# EAGLE design MakeSpaceBadge-1 (EAGLE 7.4.0)
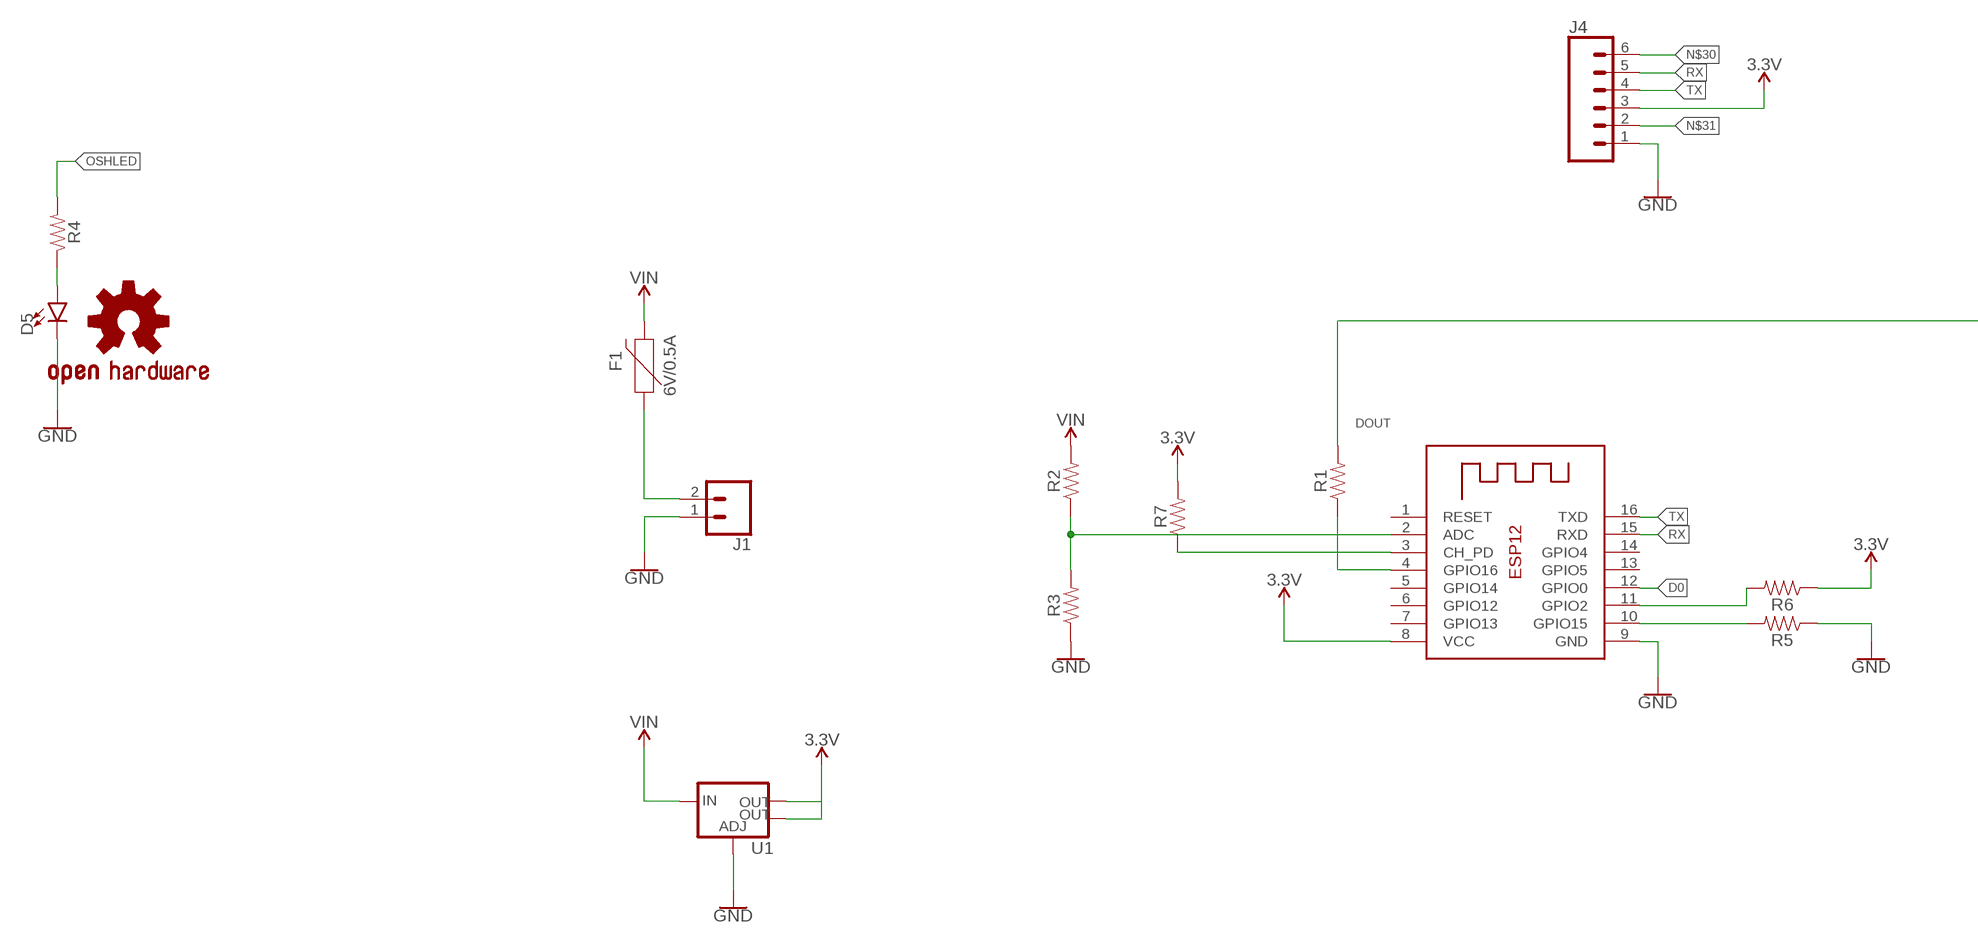
[diagram p0: schematic, sheet 1, part 1 of 2]
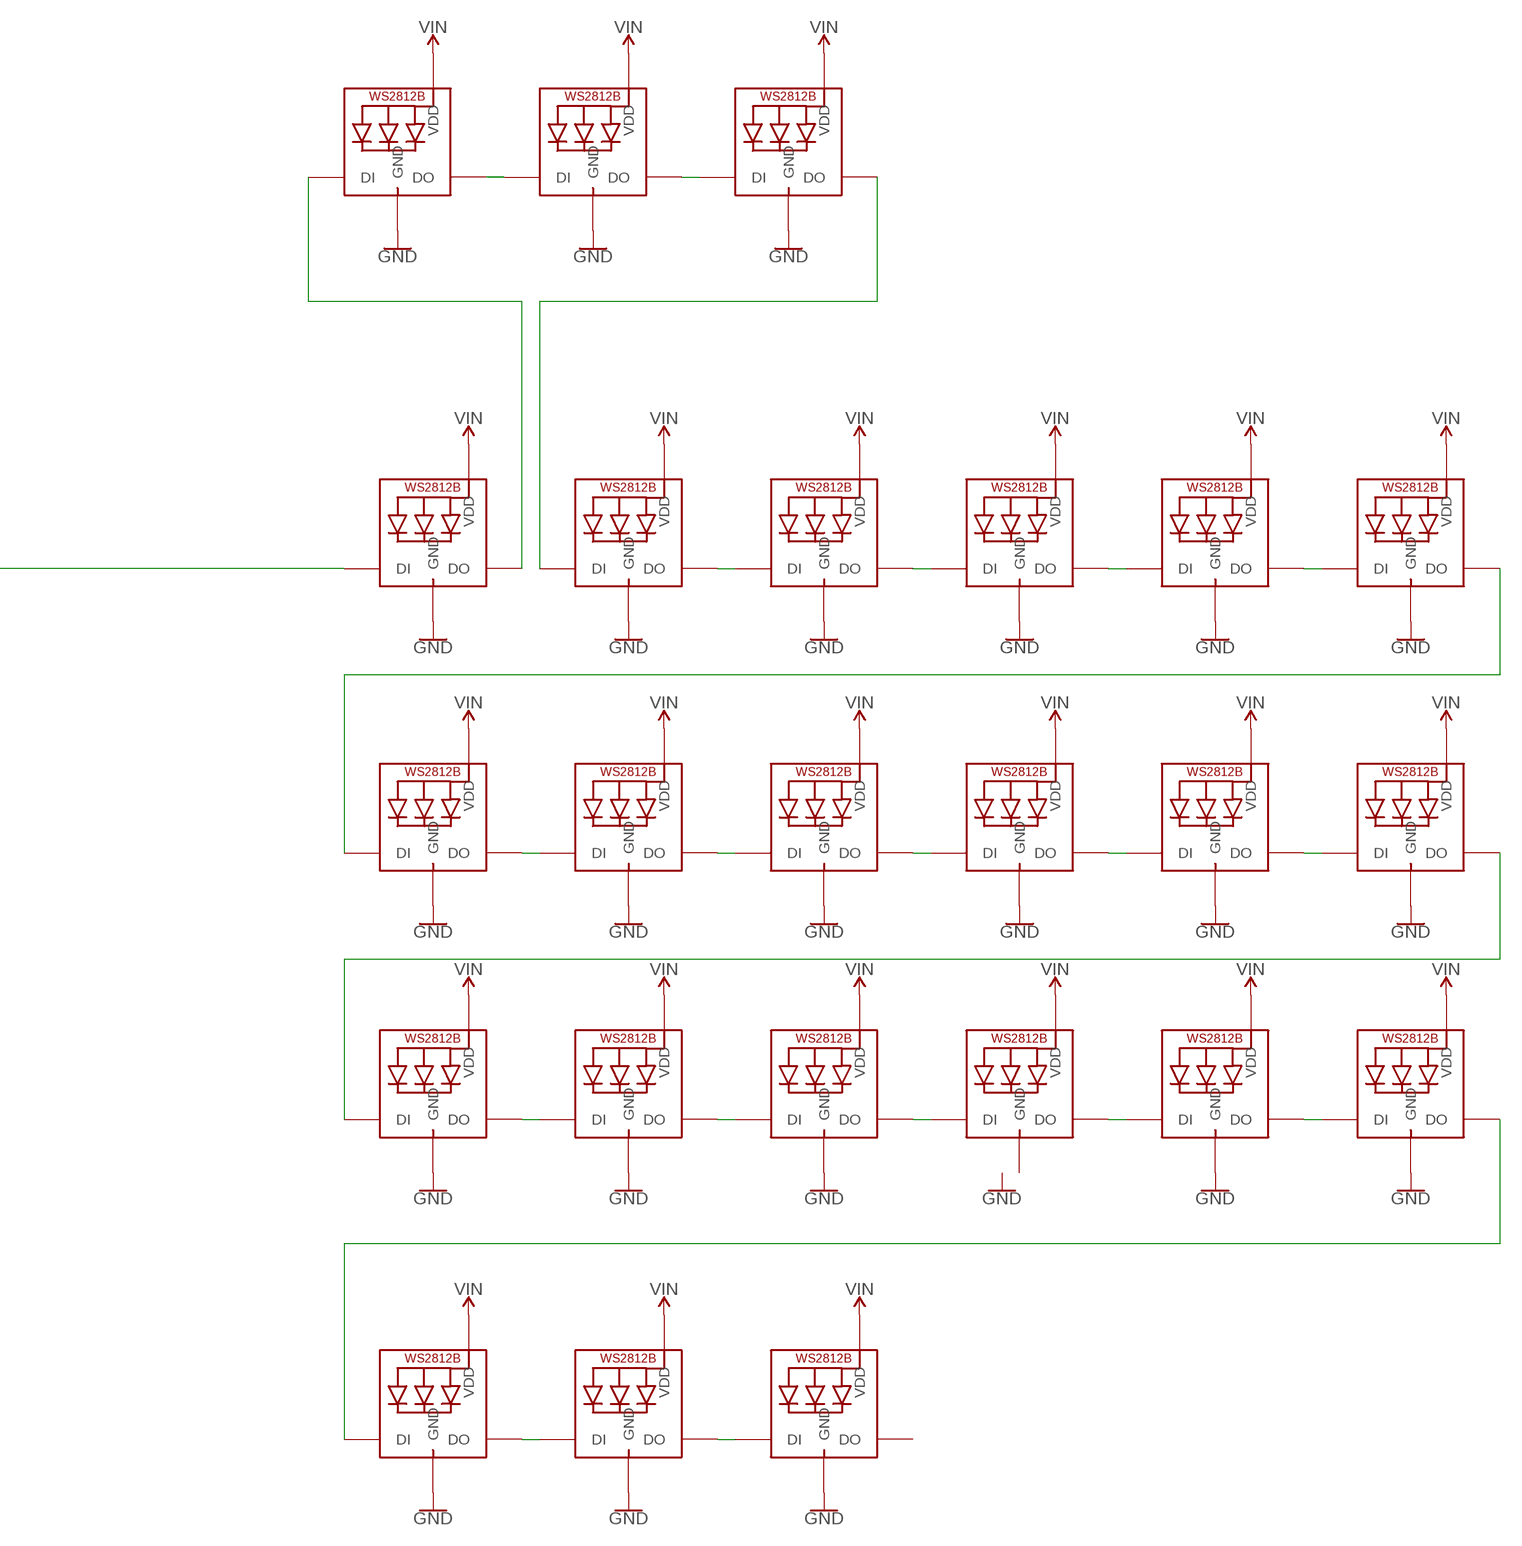
[diagram p1: schematic, sheet 1, part 2 of 2]

## Parts
D5  LED1206-BOTTOM  [LED-1206-BOTTOM]
F1  6V/0.5A  PPTC_HALF-AMP  [1206]
J1  CONN_02-JST-2MM-SMT  [JST-2-SMD]
J4  CONN_06NO_SILK_FEMALE_PTH  [1X06_NO_SILK]
LED1  WS2812BBIGPADS  [WS2812B-BIGPADS]
LED2  WS2812B5050  [WS2812B]
LED3  WS2812BBIGPADS  [WS2812B-BIGPADS]
LED4  WS2812BBIGPADS  [WS2812B-BIGPADS]
LED5  WS2812B5050  [WS2812B]
LED6  WS2812B5050  [WS2812B]
LED7  WS2812B5050  [WS2812B]
LED8  WS2812B5050  [WS2812B]
LED9  WS2812BBIGPADS  [WS2812B-BIGPADS]
LED10  WS2812BBIGPADS  [WS2812B-BIGPADS]
LED11  WS2812BBIGPADS  [WS2812B-BIGPADS]
LED12  WS2812B5050  [WS2812B]
LED13  WS2812BBIGPADS  [WS2812B-BIGPADS]
LED14  WS2812B5050  [WS2812B]
LED15  WS2812B5050  [WS2812B]
LED16  WS2812B5050  [WS2812B]
LED17  WS2812B5050  [WS2812B]
LED18  WS2812BBIGPADS  [WS2812B-BIGPADS]
LED19  WS2812BBIGPADS  [WS2812B-BIGPADS]
LED20  WS2812BBIGPADS  [WS2812B-BIGPADS]
LED21  WS2812BBIGPADS  [WS2812B-BIGPADS]
LED22  WS2812B5050  [WS2812B]
LED23  WS2812B5050  [WS2812B]
LED24  WS2812B5050  [WS2812B]
LOGO1  OSHW-LOGOL-COPPER  [OSHW-LOGO-L_COPPER]
R1  RESISTOR0805  [0805]
R2  RESISTOR0805  [0805]
R3  RESISTOR0805  [0805]
R4  RESISTOR0805  [0805]
R5  RESISTOR0805  [0805]
R6  RESISTOR0805  [0805]
R7  RESISTOR0805  [0805]
U1  V_REG_LM1117SOT223  [SOT223]
X1  ESP-12  [ESP-12]

## Nets
3.3V: J4.3 R6.1 R7.2 U1.2(OUT) U1.4(OUT) X1.8(VCC)
D0: X1.12(GPIO0)
DOUT: LED1.4-DIN(DI) R1.2
GND: D5.C J1.1 J4.1 LED1.3-GND(GND) LED2.3-GND(GND) LED3.3-GND(GND) LED4.3-GND(GND) LED5.3-GND(GND) LED6.3-GND(GND) LED7.3-GND(GND) LED8.3-GND(GND) LED9.3-GND(GND) LED10.3-GND(GND) LED11.3-GND(GND) LED12.3-GND(GND) LED13.3-GND(GND) LED14.3-GND(GND) LED15.3-GND(GND) LED17.3-GND(GND) LED18.3-GND(GND) LED19.3-GND(GND) LED20.3-GND(GND) LED21.3-GND(GND) LED22.3-GND(GND) LED23.3-GND(GND) LED24.3-GND(GND) R3.1 R5.1 U1.1(ADJ) X1.9(GND)
N$1: R1.1 X1.4(GPIO16)
N$2: LED1.2-DOUT(DO) LED24.4-DIN(DI)
N$3: LED2.2-DOUT(DO) LED3.4-DIN(DI)
N$4: LED3.2-DOUT(DO) LED4.4-DIN(DI)
N$5: LED4.2-DOUT(DO) LED5.4-DIN(DI)
N$6: LED5.2-DOUT(DO) LED6.4-DIN(DI)
N$7: LED6.2-DOUT(DO) LED7.4-DIN(DI)
N$8: LED7.2-DOUT(DO) LED8.4-DIN(DI)
N$9: LED8.2-DOUT(DO) LED9.4-DIN(DI)
N$10: LED9.2-DOUT(DO) LED10.4-DIN(DI)
N$11: LED10.2-DOUT(DO) LED11.4-DIN(DI)
N$12: LED11.2-DOUT(DO) LED12.4-DIN(DI)
N$13: LED12.2-DOUT(DO) LED13.4-DIN(DI)
N$14: LED13.2-DOUT(DO) LED14.4-DIN(DI)
N$15: LED14.2-DOUT(DO) LED15.4-DIN(DI)
N$16: LED15.2-DOUT(DO) LED16.4-DIN(DI)
N$17: LED16.2-DOUT(DO) LED17.4-DIN(DI)
N$18: LED17.2-DOUT(DO) LED18.4-DIN(DI)
N$19: LED18.2-DOUT(DO) LED19.4-DIN(DI)
N$20: LED19.2-DOUT(DO) LED20.4-DIN(DI)
N$21: LED20.2-DOUT(DO) LED21.4-DIN(DI)
N$22: LED2.4-DIN(DI) LED22.2-DOUT(DO)
N$23: LED23.4-DIN(DI) LED24.2-DOUT(DO)
N$24: LED22.4-DIN(DI) LED23.2-DOUT(DO)
N$25: R2.1 R3.2 X1.2(ADC)
N$26: D5.A R4.1
N$27: R5.2 X1.10(GPIO15)
N$28: F1.1 J1.2
N$29: R6.2 X1.11(GPIO2)
N$30: J4.6
N$31: J4.2
N$32: R7.1 X1.3(CH_PD)
OSHLED: R4.2
RX: J4.5 X1.15(RXD)
TX: J4.4 X1.16(TXD)
VIN: F1.2 LED1.1-VDD(VDD) LED2.1-VDD(VDD) LED3.1-VDD(VDD) LED4.1-VDD(VDD) LED5.1-VDD(VDD) LED6.1-VDD(VDD) LED7.1-VDD(VDD) LED8.1-VDD(VDD) LED9.1-VDD(VDD) LED10.1-VDD(VDD) LED11.1-VDD(VDD) LED12.1-VDD(VDD) LED13.1-VDD(VDD) LED14.1-VDD(VDD) LED15.1-VDD(VDD) LED16.1-VDD(VDD) LED17.1-VDD(VDD) LED18.1-VDD(VDD) LED19.1-VDD(VDD) LED20.1-VDD(VDD) LED21.1-VDD(VDD) LED22.1-VDD(VDD) LED23.1-VDD(VDD) LED24.1-VDD(VDD) R2.2 U1.3(IN)
Unconnected: LED21.2-DOUT(DO) X1.1(RESET) X1.5(GPIO14) X1.6(GPIO12) X1.7(GPIO13) X1.13(GPIO5) X1.14(GPIO4)

## Power pins joined to a net without a drawn wire
GND: LED16.3-GND(GND)

## Library data of the parts
D5 = SparkFun-LED:LED: LED (Generic) Standard schematic elements and footprints for 5mm, 3mm, 1206, and 0603 sized LEDs. Generic LEDs with no color specified.
F1 = SparkFun-Fuses:PPTC: Resettable Fuse PPTC Resettable Fuse. Really a sort of resistor with a polymeric positive temperature coefficient whose resistance increases dramatically with an increase in temperature. When heated by the power passing through the resistance rises causing the current to be limited, protecting the circuit. This is achieved by the transition of the polymer from a crystalline to an amorphous state where the conductive carbon separates breaking the conductive pathways found in the cool crystalline structure. When a PPTC cools back down it resumes conducting letting the circuit turn back on. SparkFun Products: SparkFun RedBoard - Programmed with Arduino <https://www.sparkfun.com/products/12757> Pro Micro - 5V/16MHz <https://www.sparkfun.com/products/12640> Arduino Pro 328 - 5V/16MHz <https://www.sparkfun.com/products/10915> MP3 Trigger <https://www.sparkfun.com/products/13720>; PROD_ID: RES-08585
J1 = SparkFun-Connectors:CONN_02: Multi connection point. Often used as Generic Header-pin footprint for 0.1 inch spaced/style header connections On any of the 0.1 inch spaced packages, you can populate with these: Break Away Headers - Straight <https://www.sparkfun.com/products/116> (PRT-00116) Break Away Male Headers - Right Angle <https://www.sparkfun.com/products/553> (PRT-00553) Female Headers <https://www.sparkfun.com/products/115> (PRT-00115) Break Away Headers - Machine Pin <https://www.sparkfun.com/products/117> (PRT-00117) Break Away Female Headers - Swiss Machine Pin <https://www.sparkfun.com/products/743> (PRT-00743) For SCREWTERMINALS and SPRING TERMINALS visit here: Screw Terimnals on SparkFun.com <https://www.sparkfun.com/search/results?term=Screw+Terminals> (5mm/3.5mm/2.54mm spacing) This device is also useful as a general connection point to wire up your design to another part of your project. Our various solder wires solder well into these plated through hole pads. Hook-Up Wire - Assortment (Stranded, 22 AWG) <https://www.sparkfun.com/products/11375> (PRT-11375) Hook-Up Wire - Assortment (Solid Core, 22 AWG) <https://www.sparkfun.com/products/11367> (PRT-11367) View the entire wire category on our website here <https://www.sparkfun.com/categories/141> Special notes: Molex polarized connector foot print use with: PRT-08233 with associated crimp pins and housings. 2.54_SCREWTERM for use with PRT-10571. 3.5mm Screw Terminal footprints for PRT-08084 5mm Screw Terminal footprints for use with PRT-08432; PROD_ID: CONN-11443
J4 = SparkFun-Connectors:CONN_06: Multi connection point. Often used as Generic Header-pin footprint for 0.1 inch spaced/style header connections On any of the 0.1 inch spaced packages, you can populate with these: Break Away Headers - Straight <https://www.sparkfun.com/products/116> (PRT-00116) Break Away Male Headers - Right Angle <https://www.sparkfun.com/products/553> (PRT-00553) Female Headers <https://www.sparkfun.com/products/115> (PRT-00115) Break Away Headers - Machine Pin <https://www.sparkfun.com/products/117> (PRT-00117) Break Away Female Headers - Swiss Machine Pin <https://www.sparkfun.com/products/743> (PRT-00743) Arduino Stackable Header - 6 Pin <https://www.sparkfun.com/products/9280> (PRT-09280) For SCREWTERMINALS and SPRING TERMINALS visit here: Screw Terimnals on SparkFun.com <https://www.sparkfun.com/search/results?term=Screw+Terminals> (5mm/3.5mm/2.54mm spacing) This device is also useful as a general connection point to wire up your design to another part of your project. Our various solder wires solder well into these plated through hole pads. Hook-Up Wire - Assortment (Stranded, 22 AWG) <https://www.sparkfun.com/products/11375> (PRT-11375) Hook-Up Wire - Assortment (Solid Core, 22 AWG) <https://www.sparkfun.com/products/11367> (PRT-11367) View the entire wire category on our website here <https://www.sparkfun.com/categories/141>; PROD_ID: CONN-08437
LED1-LED24 = ThingySticks:WS2812B
LOGO1 = SparkFun-Aesthetics:OSHW-LOGO: Open-Source Hardware (OSHW) Logo This logo indicates the piece of hardware it is found on incorporates a OSHW license and/or adheres to the definition of open source hardware found here: http://freedomdefined.org/OSHW
R1-R7 = SparkFun-Resistors:RESISTOR: Generic Resistor Package
U1 = SparkFun-IC-Power:V_REG_LM1117: Voltage Regulator LM1117 Standard adjustable voltage regulator but in SMD form. Spark Fun Electronics SKU : COM-00595; PROD_ID: VREG-08170
X1 = adafruit:ESP-12

## Board
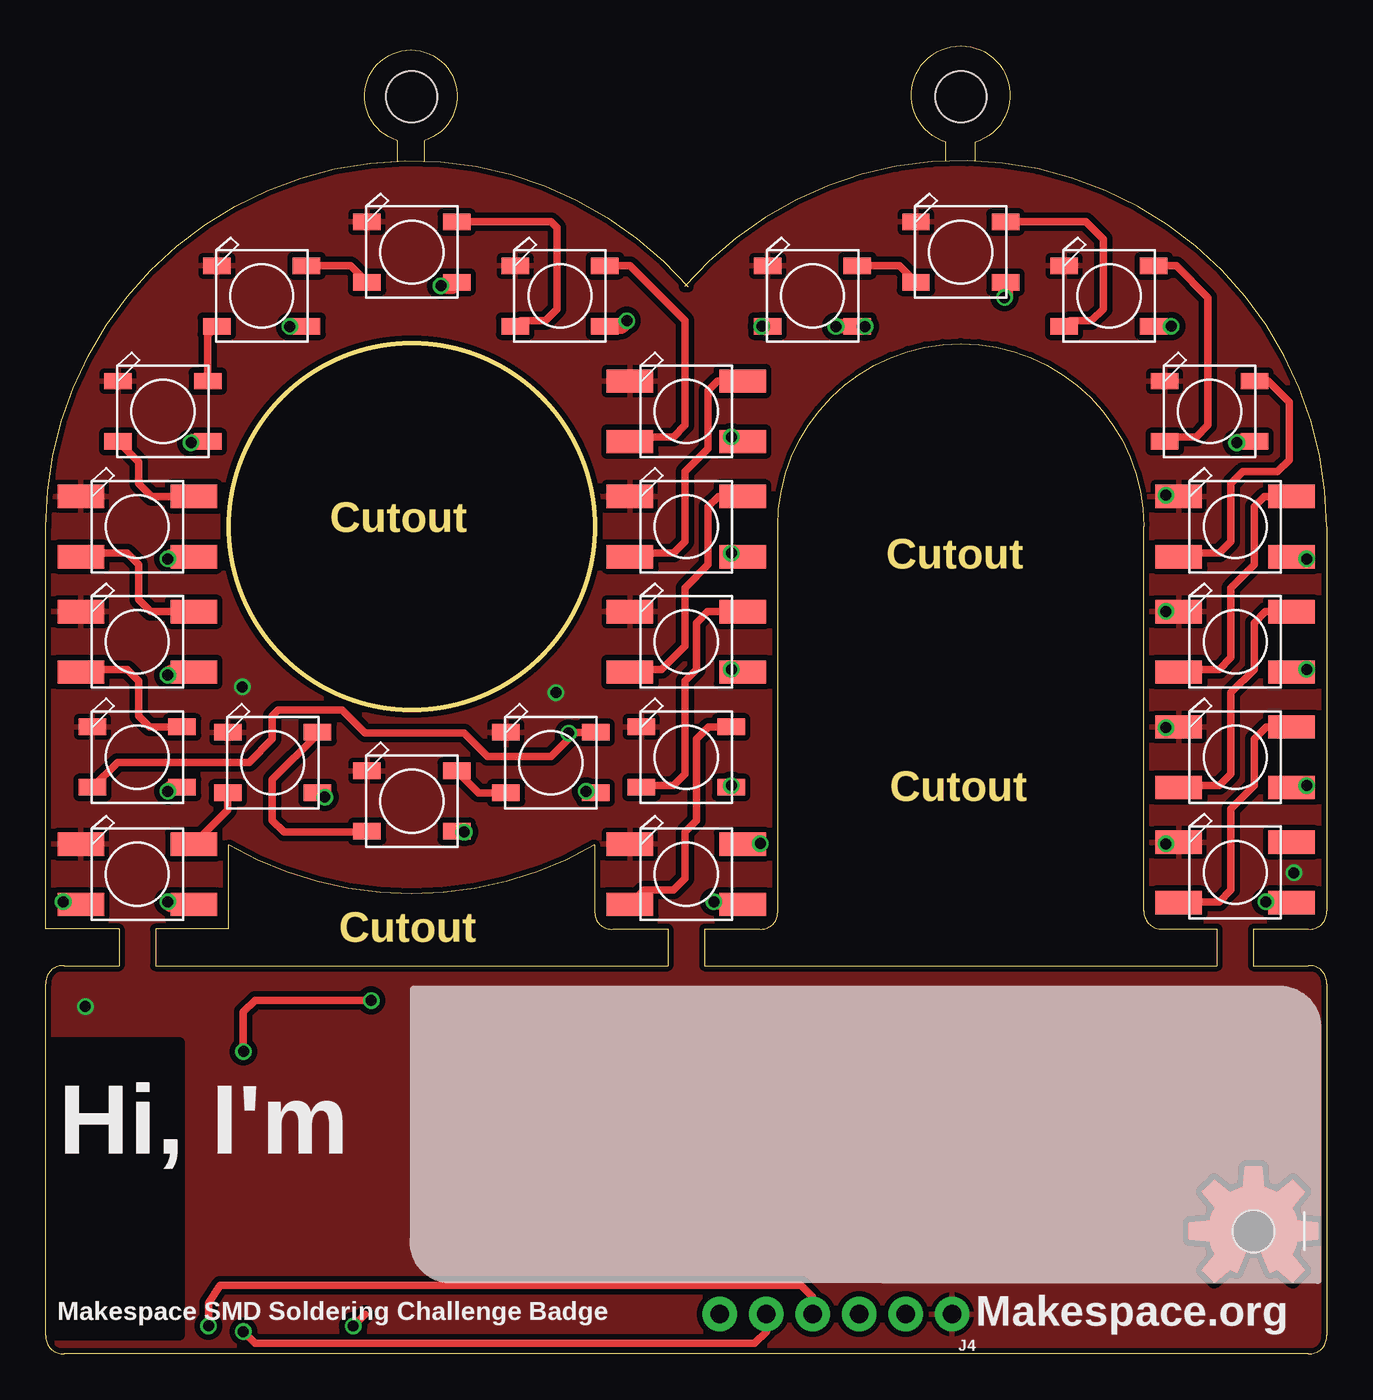
[diagram p2: board, top side]
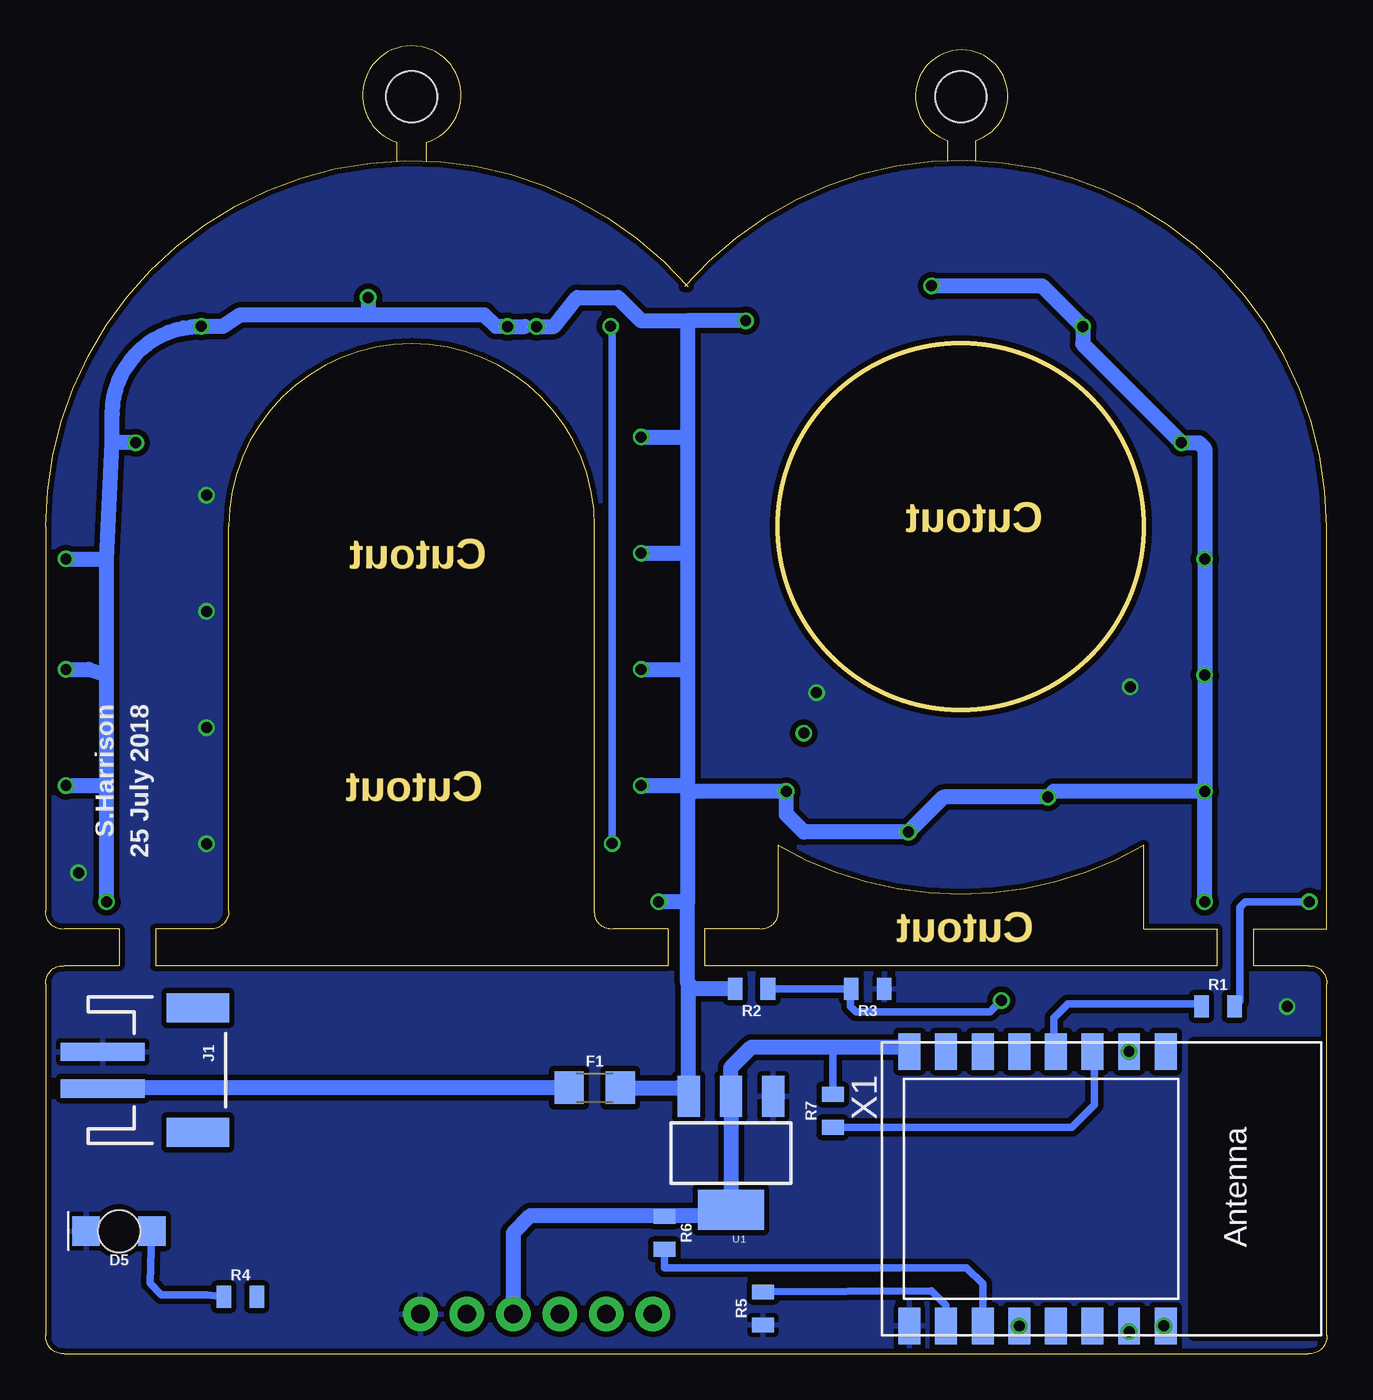
[diagram p3: board, bottom side, seen from below]

Size 70.01 x 71.48 mm. Coordinates in mm from the lower left corner, seen from the top.
Outline: 20.7,65.17 20.7,66.3 arc326 19.2,66.3 19.2,65.17
Outline: 49.2,65.17 49.2,66.2 arc-326 50.8,66.2 50.8,65.17
Outline: 35.1,58.3 arc139 0,45.2 0,23.2 4,23.2 4,21.2 1,21.2 arc99 0,20.2 0,1 arc99 1,0 69,0 arc99 70,1 70,20.2 arc99 69,21.2 66,21.2 66,23.2 69,23.2 arc99 70,24.2 70,45.2 arc139 34.9,58.3
Outline: 10,23.2 10,27.8 arc60 30,27.8 30,24.2 arc99 31,23.2 34,23.2 34,21.2 6,21.2 6,23.2 10,23.2
Outline: 40,45.2 arc-180 60,45.2 60,24.2 arc90 61,23.2 64,23.2 64,21.2 36,21.2 36,23.2 39,23.2 arc99 40,24.2 40,45.2
Outline: circle at 20,45.2 radius 10
Copper layers (1*16): Top 0.035mm / dielectric 1.5mm / Bottom 0.035mm
Design rules "dirt_cheap_dirty_boards.v1": minimum track width 5mil, minimum drill 12mil, track to track 5mil, track to pad 5mil, pad to pad 5mil, via to via 5mil, smd to smd 0mil, copper to edge 10mil, drill to drill 10mil, minimum pad ring 10mil, minimum via ring 6mil, stop-mask expansion 2mil, vias tented up to drill 25mil, thermal gap 10mil
Holes 2.8 mm at 20,68.7 50,68.7

### Footprints (pad centres in the part's own frame; a part is rotated, then mirrored left to right if it is on the bottom)
LED-1206-BOTTOM = smd 1.5 x 1.6: A -1.8,0; C 1.8,0 | hole 2.3: 0,0
1206 = smd 1.6 x 1.8: 1 -1.4,0; 2 1.4,0
JST-2-SMD = smd 1 x 4.6: 1 -1,-3.7; 2 1,-3.7 | smd 1.6 x 3.4: NC1 -3.4,1.5; NC2 3.4,1.5
1X06_NO_SILK = drill 1.016 pad 1.88: 1 0,0; 2 2.54,0; 3 5.08,0; 4 7.62,0; 5 10.16,0; 6 12.7,0
WS2812B-BIGPADS = smd 2.54 x 1.27: 1-VDD 3.085,-1.65; 2-DOUT 3.085,1.65; 3-GND -3.085,1.65; 4-DIN -3.085,-1.65
WS2812B = smd 1.5 x 0.9: 1-VDD 2.45,-1.65; 2-DOUT 2.45,1.65; 3-GND -2.45,1.65; 4-DIN -2.45,-1.65
0805 = smd 0.8 x 1.2: 1 -0.9,0; 2 0.9,0
SOT223 = smd 1.219 x 2.235: 1 -2.311,-3.099; 2 0,-3.099; 3 2.311,-3.099 | smd 3.6 x 2.2: 4 0,3.099
ESP-12 = smd 2 x 1.2: 1 -7.5,4.5; 2 -7.5,2.5; 3 -7.5,0.5; 4 -7.5,-1.5; 5 -7.5,-3.5; 6 -7.5,-5.5; 7 -7.5,-7.5; 8 -7.5,-9.5; 9 7.5,-9.5; 10 7.5,-7.5; 11 7.5,-5.5; 12 7.5,-3.5; 13 7.5,-1.5; 14 7.5,0.5; 15 7.5,2.5; 16 7.5,4.5

### Placement (x,y rotation side)
D5  66,6.7 180 bottom
F1  40.01,14.54 0 bottom
J1  63.19,15.5 270 bottom
J4  49.53,2.16 180 top
LED1  5,26.2 0 top
LED2  5,32.6 0 top
LED3  5,38.9 0 top
LED4  5,45.2 0 top
LED5  6.4,51.5 0 top
LED6  11.8,57.8 0 top
LED7  20,60.2 0 top
LED8  28.1,57.8 0 top
LED9  35,51.5 0 top
LED10  35,45.2 0 top
LED11  35,38.9 0 top
LED12  35,32.6 0 top
LED13  35,26.2 0 top
LED14  41.9,57.8 0 top
LED15  50,60.2 0 top
LED16  58.1,57.8 0 top
LED17  63.6,51.5 0 top
LED18  65,45.2 0 top
LED19  65,38.9 0 top
LED20  65,32.6 0 top
LED21  65,26.3 0 top
LED22  27.6,32.3 0 top
LED23  20,30.2 0 top
LED24  12.4,32.3 0 top
LOGO1  66,6.7 0 top
R1  5.95,18.98 0 bottom
R2  31.44,19.94 180 bottom
R3  25.09,19.94 180 bottom
R4  59.38,3.11 0 bottom
R5  30.8,2.48 90 bottom
R6  36.2,6.61 270 bottom
R7  26.99,13.27 90 bottom
U1  32.56,10.97 180 bottom
X1  13.3,9.02 270 bottom

### Tracks (layer width: path | path; a pad name or v marks a point on that pad's centre or on a via)
3.3V
  Bottom 0.406: R6.1 33.07,7.51 33.02,7.56 32.87,7.56 U1.4 | R7.2 26.99,16.76
  Bottom 0.813: U1.4 U1.2 32.56,15.64 31.44,16.76 26.99,16.76 23.19,16.76 X1.8 | J4.3 44.45,6.61 43.5,7.56 33.02,7.56
D0  (via drill 0.6)
  Top 0.406: 17.45,2.16 X1.12
  Bottom 0.406: 16.8,0.92 16.83,0.89 16.83,1.49 X1.12
  other vias: 16.8,1.52
DOUT  (via drill 0.6)
  Top 0.406: v0.96,24.7 1.77,24.7 LED1.4-DIN
  Bottom 0.406: v0.96,24.7 4.45,24.7 4.77,24.38 4.77,19.26 R1.2
GND  (via drill 0.6)
  other vias: 61.22,27.87 61.22,34.22 61.22,40.57 61.22,46.92 68.21,26.28 2.17,18.98 27.88,36.12 10.74,36.44
  pour Top (isolate 0.305): -0.8,0.6 0.6,-0.8 70,-0.7 70.2,72.5 -1.5,72.5
  pour Bottom (isolate 0.305): -0.7,-0.2 1,-0.2 70.4,-0.1 70.3,71.7 -1.4,71.7
N$1
  Bottom 0.406: R1.1 7.13,19.13 14.15,19.13 14.92,18.35 14.92,16.64 X1.4
N$2
  Top 0.406: LED1.2-DOUT 9.95,29.72 LED24.4-DIN
N$3
  Top 0.406: LED2.2-DOUT 5.69,34.25 5.08,34.86 5.08,36.77 4.45,37.4 2.07,37.4 LED3.4-DIN
N$4
  Top 0.406: LED3.2-DOUT 5.74,40.55 5.08,41.21 5.08,43.12 4.45,43.75 2.12,43.75 LED4.4-DIN
N$5
  Top 0.406: LED4.2-DOUT 5.79,46.85 5.08,47.56 5.08,48.72 LED5.4-DIN
N$6
  Top 0.406: LED5.2-DOUT 8.85,55.65 LED6.4-DIN
N$7
  Top 0.406: LED6.2-DOUT 16.65,59.45 LED7.4-DIN
N$8
  Top 0.406: LED7.2-DOUT 27.62,61.85 27.94,61.53 27.94,57.09 27.31,56.45 25.95,56.45 LED8.4-DIN
N$9
  Top 0.406: LED8.2-DOUT 31.93,59.45 34.93,56.45 34.93,50.74 34.29,50.1 32.17,50.1 LED9.4-DIN
N$10
  Top 0.406: LED9.2-DOUT 36.71,53.15 36.2,52.64 36.2,49.47 34.93,48.2 34.93,44.39 34.29,43.75 32.12,43.75 LED10.4-DIN
N$11
  Top 0.406: LED10.2-DOUT 36.76,46.85 36.2,46.29 36.2,43.12 34.93,41.85 34.93,38.67 33.66,37.4 32.07,37.4 LED11.4-DIN
N$12
  Top 0.406: LED11.2-DOUT 36.17,40.55 35.56,39.94 35.56,37.4 34.93,36.77 34.93,31.69 34.29,31.05 32.65,31.05 LED12.4-DIN
N$13
  Top 0.406: LED12.2-DOUT 36.22,34.25 35.56,33.59 35.56,29.15 34.93,28.51 34.93,25.97 34.29,25.34 32.7,25.34 LED13.4-DIN
N$14  (via drill 0.6)
  Top 0.406: LED13.2-DOUT v39.06,27.88 | v39.14,56.15 LED14.4-DIN 39.67,56.15 39.37,55.82 39.69,56.23 v39.14,56.15
  Bottom 0.406: v39.06,27.88 39.06,56.07 v39.14,56.15
N$15
  Top 0.406: LED14.2-DOUT 46.65,59.45 LED15.4-DIN
N$16
  Top 0.406: LED15.2-DOUT 56.83,61.85 57.79,60.9 57.79,57.09 57.15,56.45 55.95,56.45 LED16.4-DIN
N$17
  Top 0.406: LED16.2-DOUT 61.77,59.45 63.5,57.72 63.5,50.74 62.87,50.1 61.4,50.1 LED17.4-DIN
N$18
  Top 0.406: LED17.2-DOUT 66.8,53.15 67.95,52.01 67.95,48.83 67.31,48.2 65.41,48.2 64.77,47.56 64.77,44.39 64.14,43.75 62.12,43.75 LED18.4-DIN
N$19
  Top 0.406: LED18.2-DOUT 66.6,46.85 66.04,46.29 66.04,43.12 64.77,41.85 64.77,38.04 64.14,37.4 62.07,37.4 LED19.4-DIN
N$20
  Top 0.406: LED19.2-DOUT 66.65,40.55 66.04,39.94 66.04,37.4 64.77,36.13 64.77,31.69 64.14,31.05 62.02,31.05 LED20.4-DIN
N$21
  Top 0.406: LED20.2-DOUT 66.7,34.25 66.04,33.59 66.04,31.05 64.77,29.78 64.77,25.34 64.14,24.7 61.97,24.7 LED21.4-DIN
N$22  (via drill 0.6)
  Top 0.406: LED22.2-DOUT 28.62,33.95 v28.58,33.91 28.58,33.59 27.62,32.64 24.13,32.64 22.86,33.91 17.46,33.91 16.19,35.18 12.7,35.18 12.39,34.86 12.39,33.59 11.12,32.32 3.92,32.32 LED2.4-DIN
N$23
  Top 0.406: LED24.2-DOUT 14.85,33.84 12.39,31.37 12.39,29.15 13.02,28.51 17.51,28.51 LED23.4-DIN
N$24
  Top 0.406: LED23.2-DOUT 23.65,30.65 LED22.4-DIN
N$25  (via drill 0.6)
  Top 0.406: X1.2 10.8,18.67 11.43,19.3 v17.78,19.3
  Bottom 0.406: R2.1 R3.2 26.04,19.89 26.04,18.99 25.72,18.67 18.42,18.67 v17.78,19.3 | X1.2 10.8,17.08 X1.2
  other vias: 10.8,16.52
N$26
  Bottom 0.406: D5.A 64.3,3.84 63.69,3.22 61.2,3.22 R4.1
N$27
  Bottom 0.406: X1.10 20.8,2.64 21.59,3.43 R5.2
N$28
  Bottom 0.813: F1.1 66.84,14.54 J1.2
N$29
  Bottom 0.406: X1.11 18.8,3.81 19.69,4.7 36.2,4.7 R6.2
N$32
  Bottom 0.406: R7.1 13.92,12.37 12.7,13.59 12.7,16.41 X1.3
RX  (via drill 0.6)
  Top 0.406: J4.5 39.37,1.21 38.74,0.57 11.43,0.57 v10.8,1.21
  Bottom 0.406: v10.8,1.21 10.8,1.19 X1.15
TX  (via drill 0.6)
  Top 0.406: J4.4 41.91,3.11 41.28,3.75 9.53,3.75 8.89,2.8 v8.89,1.52
  Bottom 0.406: v8.89,1.52 8.89,1.42 X1.16
VIN  (via drill 0.6)
  Top 0.406: 22.23,58.33 LED7.1-VDD
  Top 0.813: v36.52,24.7 37.94,24.7 LED13.1-VDD | LED12.1-VDD 37.47,30.95 v37.47,31.05 | LED9.1-VDD 37.47,49.85 v37.47,50.1 | LED10.1-VDD 37.47,43.55 v37.47,43.75 | LED11.1-VDD 37.47,37.25 v37.47,37.4 | v43.18,56.14 43.82,56.15 LED14.1-VDD 44.75,56.15 v44.77,56.14 | LED8.1-VDD 31.45,56.15 v31.75,56.45 | LED21.1-VDD 67.36,24.65 v66.68,24.7 | LED17.1-VDD 65.16,49.85 v65.09,49.78 | LED18.1-VDD 68.78,43.55 v68.9,43.44 | LED19.1-VDD 68.75,37.25 v68.9,37.4 | LED20.1-VDD 68.8,30.95 v68.9,31.05 | v61.5,56.15 LED16.1-VDD | LED15.1-VDD 52.45,57.78 v52.39,57.72 | LED22.1-VDD 29.61,30.65 v29.53,30.73 | LED23.1-VDD 22.82,28.55 v22.86,28.51 | LED24.1-VDD 15.01,30.65 v15.24,30.42 | LED2.1-VDD 6.89,30.95 v6.67,30.73 | LED1.1-VDD 6.82,24.55 v6.67,24.7 | LED3.1-VDD 6.84,37.25 v6.67,37.08 | LED4.1-VDD 6.79,43.55 v6.67,43.44 | LED5.1-VDD 8.01,49.85 v7.94,49.78 | LED6.1-VDD 13.35,56.15 v13.34,56.14 | 22.23,58.33 21.62,58.33 v21.59,58.36
  Bottom 0.813: 34.87,20.2 34.61,19.94 R2.2 | 34.93,24.7 34.93,20.26 34.87,20.2 | 34.93,24.7 v36.52,24.7 | v37.47,31.05 34.93,31.05 | 34.93,31.05 34.93,30.42 | 34.93,30.42 34.93,24.7 | v37.47,50.1 34.93,50.1 | 34.93,50.1 34.93,43.75 | 34.93,43.75 34.93,37.4 | 34.93,37.4 34.93,31.05 | v37.47,43.75 34.93,43.75 | v37.47,37.4 34.93,37.4 | v43.18,56.14 42.23,56.14 40.96,57.72 38.74,57.72 37.47,56.45 34.93,56.45 | 34.93,56.45 34.93,50.1 | v31.75,56.45 34.93,56.45 | v66.68,24.7 66.68,31.05 | 66.68,31.05 66.68,37.08 | 66.68,37.08 66.68,43.44 | 66.68,43.44 66.36,49.78 | 66.36,49.78 66.36,51.37 arc90 61.6,56.14 61.84,56.14 v61.5,56.15 61.49,56.14 60.33,56.14 59.38,56.77 52.39,56.77 | v65.09,49.78 66.36,49.78 | v68.9,43.44 66.68,43.44 | v68.9,37.4 67.63,37.4 66.68,37.08 | v68.9,31.05 66.68,31.05 | v52.39,57.72 52.39,56.77 | 43.82,56.14 v44.77,56.14 45.41,56.14 46.04,56.77 52.39,56.77 | 34.93,30.42 34.61,30.73 v29.53,30.73 29.53,29.47 28.58,28.51 v22.86,28.51 20.96,30.42 v15.24,30.42 14.92,30.73 v6.67,30.73 | v6.67,24.7 v6.67,30.73 | v6.67,30.73 v6.67,37.08 v6.67,43.44 6.67,49.47 6.99,49.78 v7.94,49.78 13.34,55.18 v13.34,56.14 15.56,58.36 v21.59,58.36 | 34.87,20.2 U1.3 35.35,14.54 35.4,14.49 35.45,14.54 F1.2

### Text on the board
Dimension: Cutout | Cutout | Cutout | Cutout
tNames: Hi, I'm | Makespace SMD Soldering Challenge Badge | Makespace.org
bNames: 25 July 2018 | S.Harrison